# Altium schematic sheet GD_Tcontroller_Relay.SchDoc
size A3
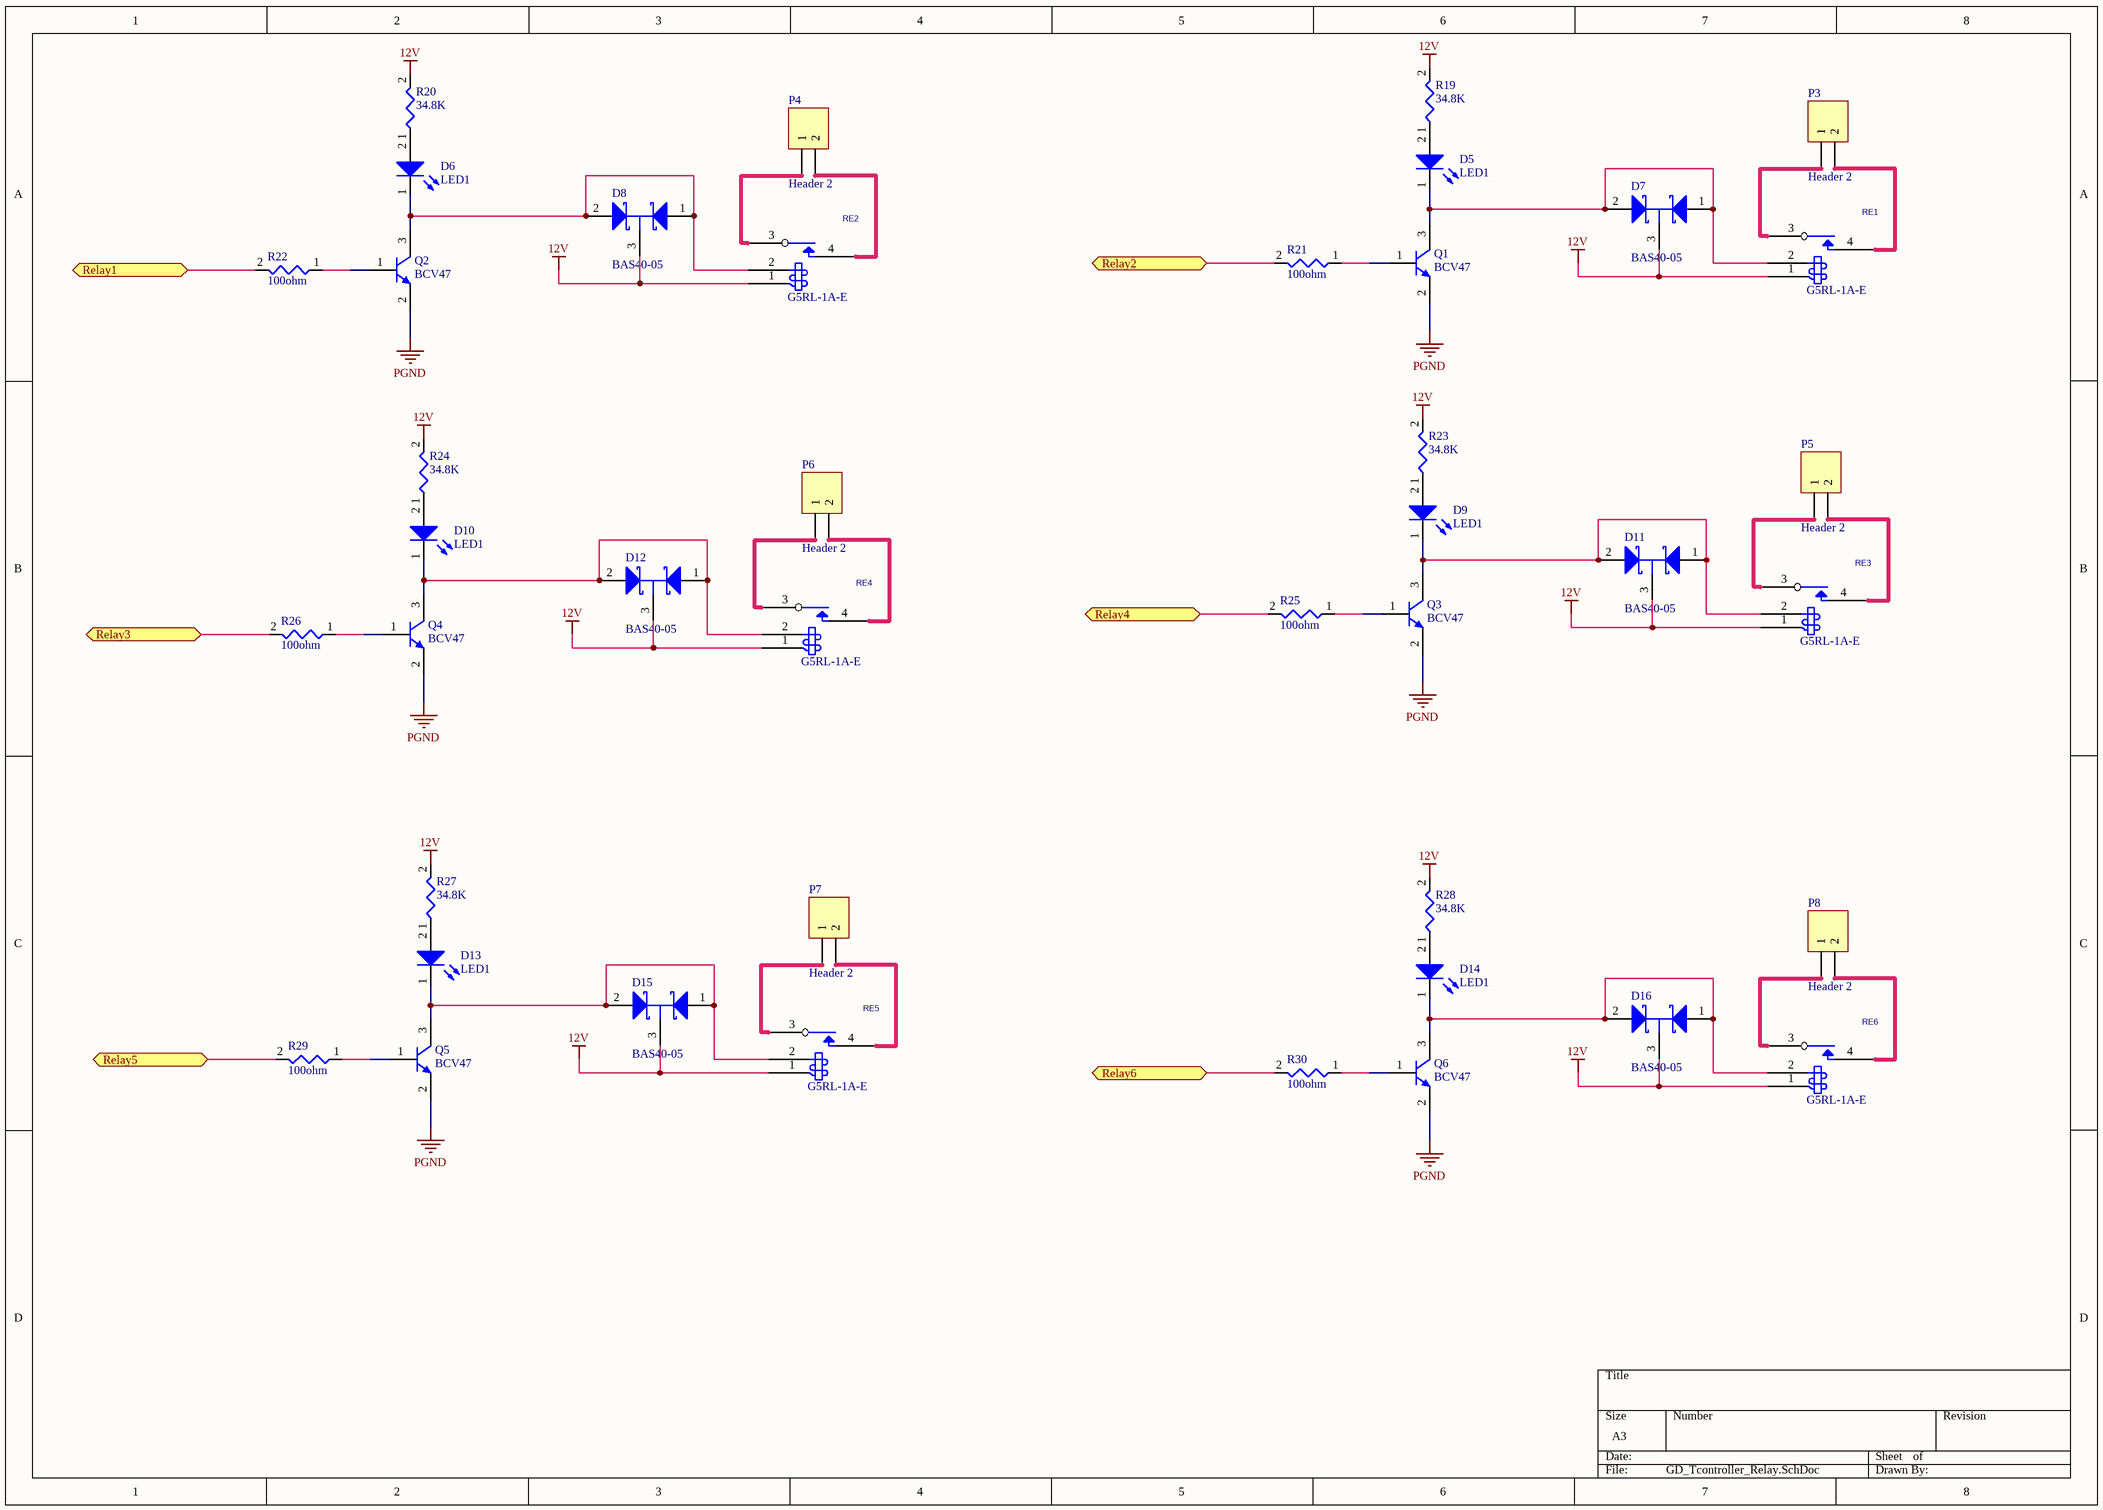
[diagram p0: GD_Tcontroller_Relay.SchDoc]

## Parts
D5  LED1  [LED0603]
D6  LED1  [LED0603]
D7  BAS40-05  [SOT23-123]
D8  BAS40-05  [SOT23-123]
D9  LED1  [LED0603]
D10  LED1  [LED0603]
D11  BAS40-05  [SOT23-123]
D12  BAS40-05  [SOT23-123]
D13  LED1  [LED0603]
D14  LED1  [LED0603]
D15  BAS40-05  [SOT23-123]
D16  BAS40-05  [SOT23-123]
P3  Header 2  [KF7.62-2P]
P4  Header 2  [KF7.62-2P]
P5  Header 2  [KF7.62-2P]
P6  Header 2  [KF7.62-2P]
P7  Header 2  [KF7.62-2P]
P8  Header 2  [KF7.62-2P]
Q1  BCV47  [INF-SOT23_L]
Q2  BCV47  [INF-SOT23_L]
Q3  BCV47  [INF-SOT23_L]
Q4  BCV47  [INF-SOT23_L]
Q5  BCV47  [INF-SOT23_L]
Q6  BCV47  [INF-SOT23_L]
R19  value 34.8K  [R0805]  (hidden comment: RES)
R20  value 34.8K  [R0805]  (hidden comment: RES)
R21  value 100ohm  [R0805]  (hidden comment: RES)
R22  value 100ohm  [R0805]  (hidden comment: RES)
R23  value 34.8K  [R0805]  (hidden comment: RES)
R24  value 34.8K  [R0805]  (hidden comment: RES)
R25  value 100ohm  [R0805]  (hidden comment: RES)
R26  value 100ohm  [R0805]  (hidden comment: RES)
R27  value 34.8K  [R0805]  (hidden comment: RES)
R28  value 34.8K  [R0805]  (hidden comment: RES)
R29  value 100ohm  [R0805]  (hidden comment: RES)
R30  value 100ohm  [R0805]  (hidden comment: RES)
RE1  RELAY SP  [G5RL-1A-E]  (value not drawn)
RE2  RELAY SP  [G5RL-1A-E]  (value not drawn)
RE3  RELAY SP  [G5RL-1A-E]  (value not drawn)
RE4  RELAY SP  [G5RL-1A-E]  (value not drawn)
RE5  RELAY SP  [G5RL-1A-E]  (value not drawn)
RE6  RELAY SP  [G5RL-1A-E]  (value not drawn)

## Ports
Relay1, Relay2, Relay3, Relay4, Relay5, Relay6

## Nets
12V: D7.3(C) D8.3(C) D11.3(C) D12.3(C) D15.3(C) D16.3(C) R19.2 R20.2 R23.2 R24.2 R27.2 R28.2 RE1.1(COIL) RE2.1(COIL) RE3.1(COIL) RE4.1(COIL) RE5.1(COIL) RE6.1(COIL)
PGND: Q1.2(E) Q2.2(E) Q3.2(E) Q4.2(E) Q5.2(E) Q6.2(E)
Relay1: R22.2 ; port Relay1
Relay2: R21.2 ; port Relay2
Relay3: R26.2 ; port Relay3
Relay4: R25.2 ; port Relay4
Relay5: R29.2 ; port Relay5
Relay6: R30.2 ; port Relay6
NetD5_1: D5.1 D7.1(A) D7.2(K) Q1.3(C) RE1.2(COIL)
NetD5_2: D5.2 R19.1
NetD6_1: D6.1 D8.1(A) D8.2(K) Q2.3(C) RE2.2(COIL)
NetD6_2: D6.2 R20.1
NetD9_1: D9.1 D11.1(A) D11.2(K) Q3.3(C) RE3.2(COIL)
NetD9_2: D9.2 R23.1
NetD10_1: D10.1 D12.1(A) D12.2(K) Q4.3(C) RE4.2(COIL)
NetD10_2: D10.2 R24.1
NetD13_1: D13.1 D15.1(A) D15.2(K) Q5.3(C) RE5.2(COIL)
NetD13_2: D13.2 R27.1
NetD14_1: D14.1 D16.1(A) D16.2(K) Q6.3(C) RE6.2(COIL)
NetD14_2: D14.2 R28.1
NetP3_1: P3.1 RE1.3(COMMON)
NetP3_2: P3.2 RE1.4(NO)
NetP4_1: P4.1 RE2.3(COMMON)
NetP4_2: P4.2 RE2.4(NO)
NetP5_1: P5.1 RE3.3(COMMON)
NetP5_2: P5.2 RE3.4(NO)
NetP6_1: P6.1 RE4.3(COMMON)
NetP6_2: P6.2 RE4.4(NO)
NetP7_1: P7.1 RE5.3(COMMON)
NetP7_2: P7.2 RE5.4(NO)
NetP8_1: P8.1 RE6.3(COMMON)
NetP8_2: P8.2 RE6.4(NO)
NetQ1_1: Q1.1(B) R21.1
NetQ2_1: Q2.1(B) R22.1
NetQ3_1: Q3.1(B) R25.1
NetQ4_1: Q4.1(B) R26.1
NetQ5_1: Q5.1(B) R29.1
NetQ6_1: Q6.1(B) R30.1

## Library data of the parts
D5 D6 D9 D10 D13 D14 = ED00024: LED BLUE 1.6x0.8x0.3mm,SMD ROHS; Manufacturer P/N: LB Q39G-N1P1-35-1; Manufacturer: OSRAM; ID: 24; Value: LB Q39G-N1P1-35-1; Type: ****; HelpURL: \\192.168.1.3\Esh\Department\RD\CAD\Component\DIODE\LED\LP3982.pdf; P/N: ED00024
D7 D8 D11 D12 D15 D16 = ED00044: DIODE Schottky Diode 40V 0.2A SOT-23 SMD ROHS; Manufacturer: NXP; ID: 44; Value: BAS40-05-V; Type: ****; HelpURL: \\192.168.1.3\Esh\Department\RD\CAD\Component\DIODE\BAS40_1PSXXSB4X_SER.pdf; P/N: ED00044; Manufacturer P/N: BAS40-05
P3-P8 = Header 2: Header, 2-Pin; LatestRevisionDate: 17-Jul-2002; LatestRevisionNote: Re-released for DXP Platform.; Publisher: Altium Limited
Q1-Q6 = CMP-1196-00014-1: NPN Silicon Darlington Transistor, 60 V VCEO, 500 mA IC, SOT23, Reel, Green; Manufacturer: Infineon; fT (typ): 170 MHz; IC (max): 500 mA; ICBO (max): 10 uA; Green: TRUE; VCE: 5 V; hFE (min): 2000; ICM (max): 800 mA; VCBO (max): 80 V; IC: 100 mA; VCEO (max): 60 V; VEBO (max): 10 V; ComponentLink1URL: http://www.infineon.com/; PackageVersion: Apr-08; ComponentLink2URL: http://www.infineon.com/dgdl/bcv27_bcv47.pdf?folderId=db3a30431441fb5d011445c30f210183&fileId=db3a30431441fb5d011445cf7c3b0188; ComponentLink2Description: Datasheet; ComponentLink1Description: Manufacturer URL; PartNumber: BCV47; Polarity: NPN; PackageReference: SOT23; PackageDescription: 3-Pin Small Outline Transistor Package, 1.3 x 2.9 mm Body, 0.95 mm Pitch; ComponentLink3URL: http://www.infineon.com/dgdl/SOT23-Package_Overview.pdf?folderId=db3a30431936bc4b0119532290053c66&fileId=db3a30431936bc4b0119533468123c85; Mounting Technology: Surface Mount; Packing: Reel; ComponentLink3Description: Package Specification
R19 R20 R23 R24 R27 R28 = ER00219: RES THICK_FILM SMD 34.8K 1% 1/8W ROHS 0805; Manufacturer: YAGEO; Manufacturer P/N: RC0805FR-0734K8; ID: 219; HelpURL: *; P/N: ER00219
R21 R22 R25 R26 R29 R30 = ER00035: RES THICK_FILM SMD 100 OHM 5% 1/8W ROHS 0805; Manufacturer: YAGEO; Manufacturer P/N: RC0805JR-07100RL; ID: 35; HelpURL: *; P/N: ER00035
RE1-RE6 = EK00005: Relay,12VDC,16A,250VAC; Manufacturer: OMRON; Value: Relay 16A; ID: 5; HelpURL: \\192.168.1.3\Esh\Department\RD\CAD\Component\relay\OMRON\G5RL_0609.pdf; P/N: EK00005; Manufacturer P/N: G5RL-1A-E; Type: *****